# EAGLE design QCCB1 (EAGLE 5.10)
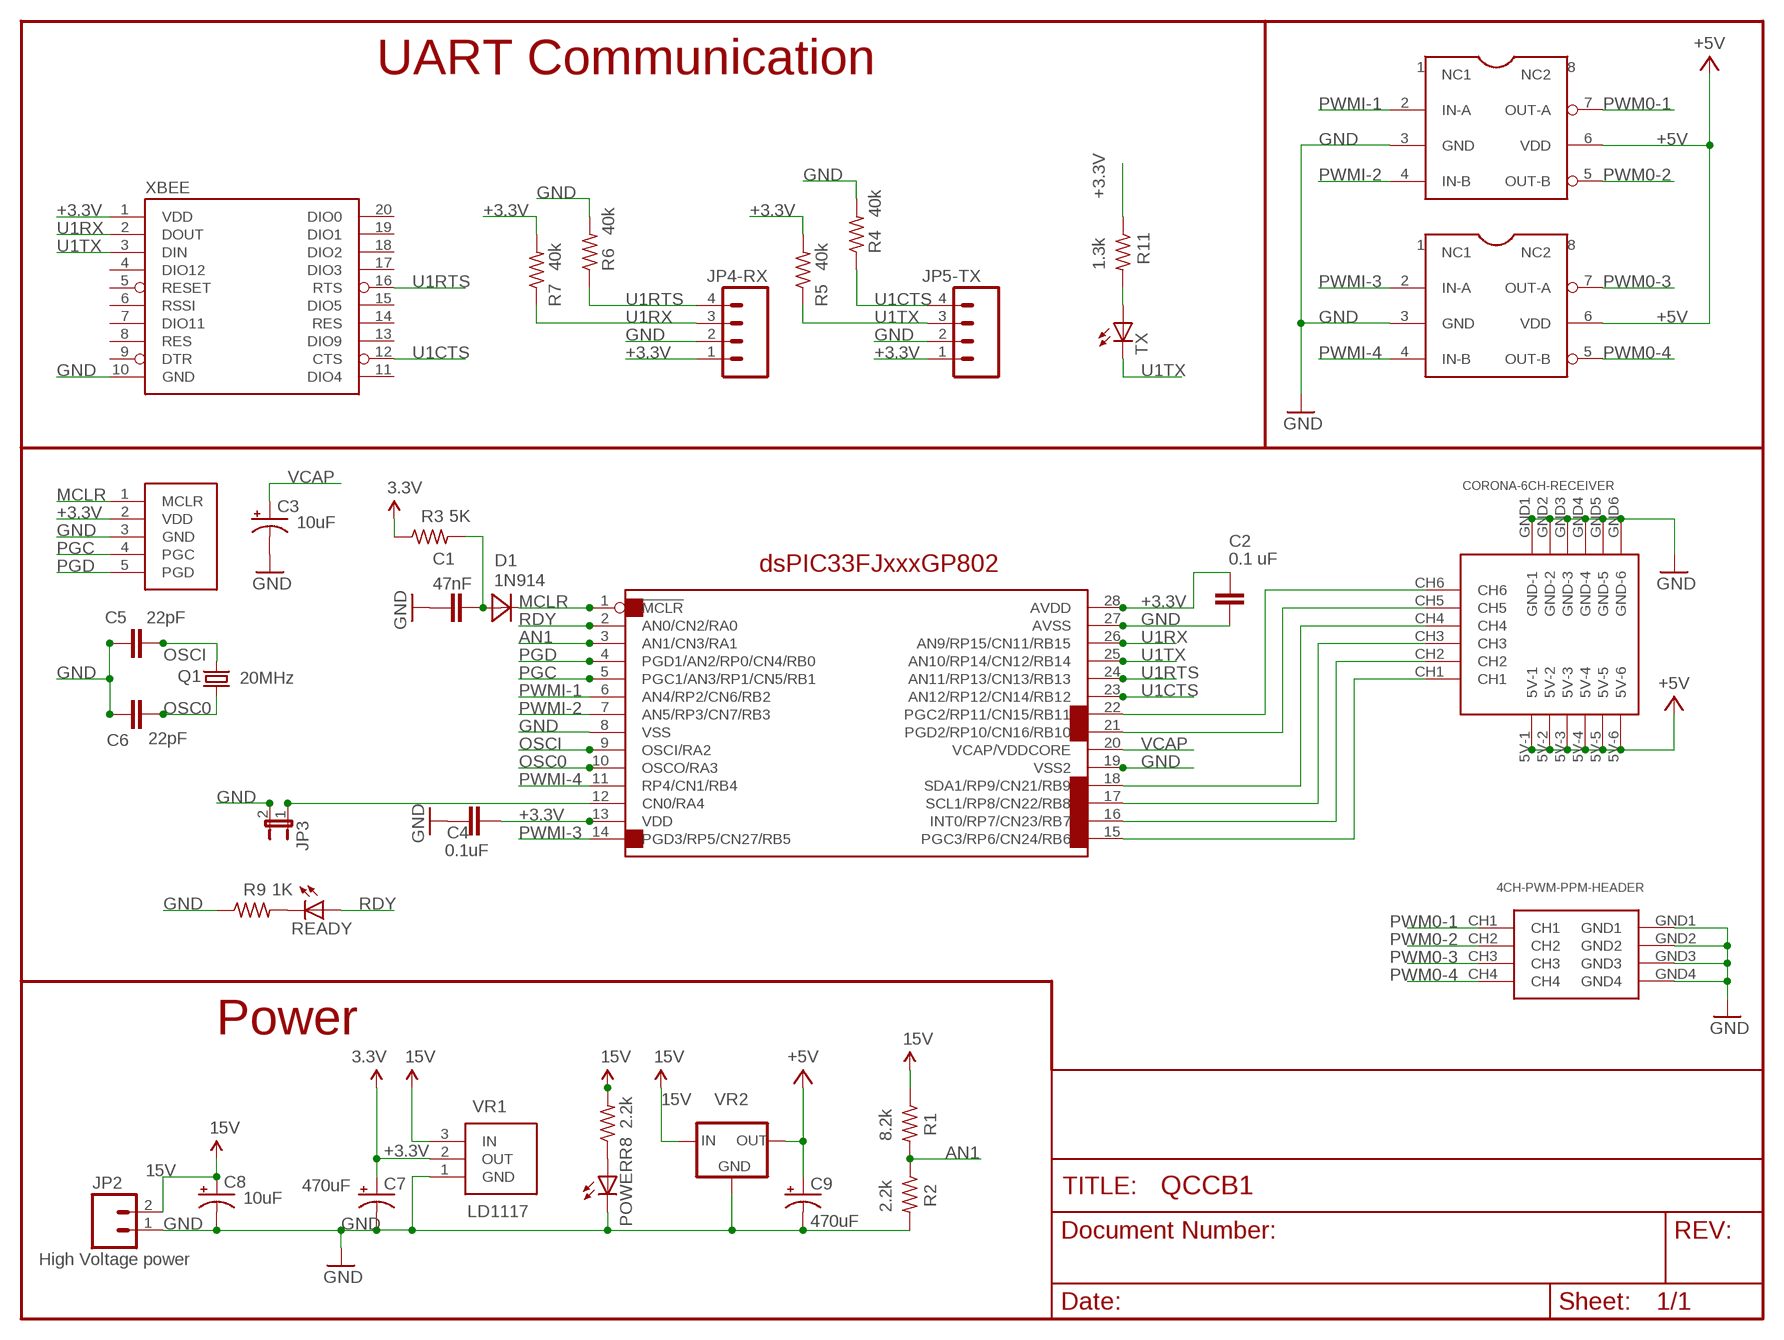
[diagram p0: schematic, sheet 1]

## Parts
C1  47nF  CAPPTH  [CAP-PTH-SMALL]
C2  0.1 uF  CAPPTH  [CAP-PTH-SMALL]
C3  10uF  CPOL-USE2-5  [E2-5]
C4  0.1uF  CAPPTH  [CAP-PTH-SMALL]
C5  22pF  CAPPTH  [CAP-PTH-SMALL]
C6  22pF  CAPPTH  [CAP-PTH-SMALL]
C7  470uF  CPOL-USE3.5-8  [E3,5-8]
C8  10uF  CPOL-USE2-5  [E2-5]
C9  470uF  CPOL-USE3.5-8  [E3,5-8]
CR1  CORONA-6CH-RECEIVER  [CORONA-6CH-RECEIVER-FOOTPRINT]
D1  1N914  [DO34-5]
ICL1  ICL7667  [DIL08]
ICL2  ICL7667  [DIL08]
ICSP  ICSPMOLEX  [ICSP_LONGPADS_MOLEX]
JP2  High Voltage power  M02  [1X02_LONGPADS]
JP3  JUMPER-2PTH_LOCK  [1X02_LOCK]
JP4-RX  M04LOCK_LONGPADS  [1X04_LOCK_LONGPADS]
JP5-TX  M04LOCK_LONGPADS  [1X04_LOCK_LONGPADS]
POWER  LED5MM  [LED5MM]
PWM-PPM  4CH-PWM-PPM-HEADER  [4CH-PWM-PPM-HEADER-PACKAGE]
Q1  20MHz  CRYSTALHC49US  [HC49US]
R1  8.2k  R-US_0204/7  [0204/7]
R2  2.2k  R-US_0204/7  [0204/7]
R3  5K  R-US_0204/7  [0204/7]
R4  40k  R-US_0204/7  [0204/7]
R5  40k  R-US_0204/7  [0204/7]
R6  40k  R-US_0204/7  [0204/7]
R7  40k  R-US_0204/7  [0204/7]
R8  2.2k  R-US_0204/7  [0204/7]
R9  1K  R-US_0204/7  [0204/7]
R11  1.3k  R-US_0204/7  [0204/7]
READY  LED3MM  [LED3MM]
TX  LED3MM  [LED3MM]
U$1  DSPIC33FJXXXGP802-DIGEST  [DIL28-3]
VR1  LD1117  [TO220S]
VR2  78XXS  [78XXS]
XBEE  XBEE-1XBEE-1_LOCK  [XBEE-1_LOCK]

## Nets
15V: C8.+ JP2.2 R1.1 R8.2 VR1.3(IN) VR2.IN
+3.3V: C2.2 C4.2 C7.+ ICSP.2(VDD) JP4-RX.1 JP5-TX.1 R3.1 R5.2 R7.2 R11.1 U$1.13(VDD) U$1.28(AVDD) VR1.2(OUT) XBEE.1(VDD) ; supply symbol labelled 3.3V
+5V: C9.+ CR1.5V-1 CR1.5V-2 CR1.5V-3 CR1.5V-4 CR1.5V-5 CR1.5V-6 ICL1.6(VDD) ICL2.6(VDD) VR2.OUT
AN1: R1.2 R2.1 U$1.3(AN1/CN3/RA1)
GND: C1.2 C2.1 C3.- C4.1 C5.1 C6.1 C7.- C8.- C9.- CR1.GND1(GND-1) CR1.GND2(GND-2) CR1.GND3(GND-3) CR1.GND4(GND-4) CR1.GND5(GND-5) CR1.GND6(GND-6) ICL1.3(GND) ICL2.3(GND) ICSP.3(GND) JP2.1 JP3.2 JP4-RX.2 JP5-TX.2 POWER.K(C) PWM-PPM.GND1 PWM-PPM.GND2 PWM-PPM.GND3 PWM-PPM.GND4 R2.2 R4.2 R6.2 R9.1 U$1.8(VSS) U$1.19(VSS2) U$1.27(AVSS) VR1.1(GND) VR2.GND XBEE.10(GND)
MCLR: D1.C ICSP.1(MCLR) U$1.1(!MCLR)
N$1: C1.1 D1.A R3.2
N$2: JP3.1 U$1.12(CN0/RA4)
N$3: R11.2 TX.A
N$4: R9.2 READY.K(C)
N$5: POWER.A R8.1
N$7: CR1.CH6 U$1.22(PGC2/RP11/CN15/RB11)
N$8: CR1.CH5 U$1.21(PGD2/RP10/CN16/RB10)
N$9: CR1.CH4 U$1.18(SDA1/RP9/CN21/RB9)
N$10: CR1.CH3 U$1.17(SCL1/RP8/CN22/RB8)
N$11: CR1.CH2 U$1.16(INT0/RP7/CN23/RB7)
N$12: CR1.CH1 U$1.15(PGC3/RP6/CN24/RB6)
OSC0: C6.2 Q1.1 U$1.10(OSCO/RA3)
OSCI: C5.2 Q1.2 U$1.9(OSCI/RA2)
PGC: ICSP.4(PGC) U$1.5(PGC1/AN3/RP1/CN5/RB1)
PGD: ICSP.5(PGD) U$1.4(PGD1/AN2/RP0/CN4/RB0)
PWM0-1: ICL1.7(OUT-A) PWM-PPM.CH1
PWM0-2: ICL1.5(OUT-B) PWM-PPM.CH2
PWM0-3: ICL2.7(OUT-A) PWM-PPM.CH3
PWM0-4: ICL2.5(OUT-B) PWM-PPM.CH4
PWMI-1: ICL1.2(IN-A) U$1.6(AN4/RP2/CN6/RB2)
PWMI-2: ICL1.4(IN-B) U$1.7(AN5/RP3/CN7/RB3)
PWMI-3: ICL2.2(IN-A) U$1.14(PGD3/RP5/CN27/RB5)
PWMI-4: ICL2.4(IN-B) U$1.11(RP4/CN1/RB4)
RDY: READY.A U$1.2(AN0/CN2/RA0)
U1CTS: JP5-TX.4 R4.1 U$1.23(AN12/RP12/CN14/RB12) XBEE.12(CTS)
U1RTS: JP4-RX.4 R6.1 U$1.24(AN11/RP13/CN13/RB13) XBEE.16(RTS)
U1RX: JP4-RX.3 R7.1 U$1.26(AN9/RP15/CN11/RB15) XBEE.2(DOUT)
U1TX: JP5-TX.3 R5.1 TX.K(C) U$1.25(AN10/RP14/CN12/RB14) XBEE.3(DIN)
VCAP: C3.+ U$1.20(VCAP/VDDCORE)
Unconnected: ICL1.1(NC1) ICL1.8(NC2) ICL2.1(NC1) ICL2.8(NC2) XBEE.4(DIO12) XBEE.5(RESET) XBEE.6(RSSI) XBEE.7(DIO11) XBEE.8(RES) XBEE.9(DTR) XBEE.11(DIO4) XBEE.13(DIO9) XBEE.14(RES) XBEE.15(DIO5) XBEE.17(DIO3) XBEE.18(DIO2) XBEE.19(DIO1) XBEE.20(DIO0)

## Notes on the sheet
- UART Communication
- Power

## Library data of the parts
C1 C2 C4-C6 = SparkFun:CAP: Capacitor Standard 0603 ceramic capacitor, and 0.1" leaded capacitor.
C3 C7-C9 = rcl:CPOL-US: POLARIZED CAPACITOR, American symbol
CR1 = AZ Custom:CORONA-6CH-RECEIVER
D1 = AZ Custom:1N914
ICL1 ICL2 = AZ Custom:ICL7667: ICL7667 Dual MOSFET driver
ICSP = AZ Custom:ICSP
JP2 = SparkFun:M02: Header 2 Standard 2-pin 0.1" header. Use with straight break away headers (SKU : PRT-00116), right angle break away headers (PRT-00553), swiss pins (PRT-00743), machine pins (PRT-00117), and female headers (PRT-00115). Molex polarized connector foot print use with SKU : PRT-08233 with associated crimp pins and housings.
JP3 = SparkFun:JUMPER-2: Jumper Basic 0.1" spaced jumper. Use with breakaway headers.
JP4-RX JP5-TX = SparkFun:M04: Header 4 Standard 4-pin 0.1" header. Use with straight break away headers (SKU : PRT-00116), right angle break away headers (PRT-00553), swiss pins (PRT-00743), machine pins (PRT-00117), and female headers (PRT-00115). Molex polarized connector foot print use with SKU : PRT-08231 with associated crimp pins and housings.
POWER READY TX = SparkFun:LED: LEDs Standard schematic elements and footprints for 5mm, 3mm, 1206, and 0603 sized LEDs. 5mm - Spark Fun Electronics SKU : COM-00529 (and others)
PWM-PPM = AZ Custom:4CH-PWM-PPM-HEADER
Q1 = SparkFun:CRYSTAL: Crystals Various standard crystals. Proven footprints. Spark Fun Electronics SKU : COM-00534
R1-R9 R11 = resistor:R-US_: RESISTOR, American symbol
U$1 = AZ Custom:DSPIC33FJXXXGP802-DIGEST
VR1 = AZ Custom:LD1117: LD1117 series voltage regulator (including LD33V)
VR2 = v-reg:78XXS: VOLTAGE REGULATOR
XBEE = AZ Custom:XBEE-1

## Board
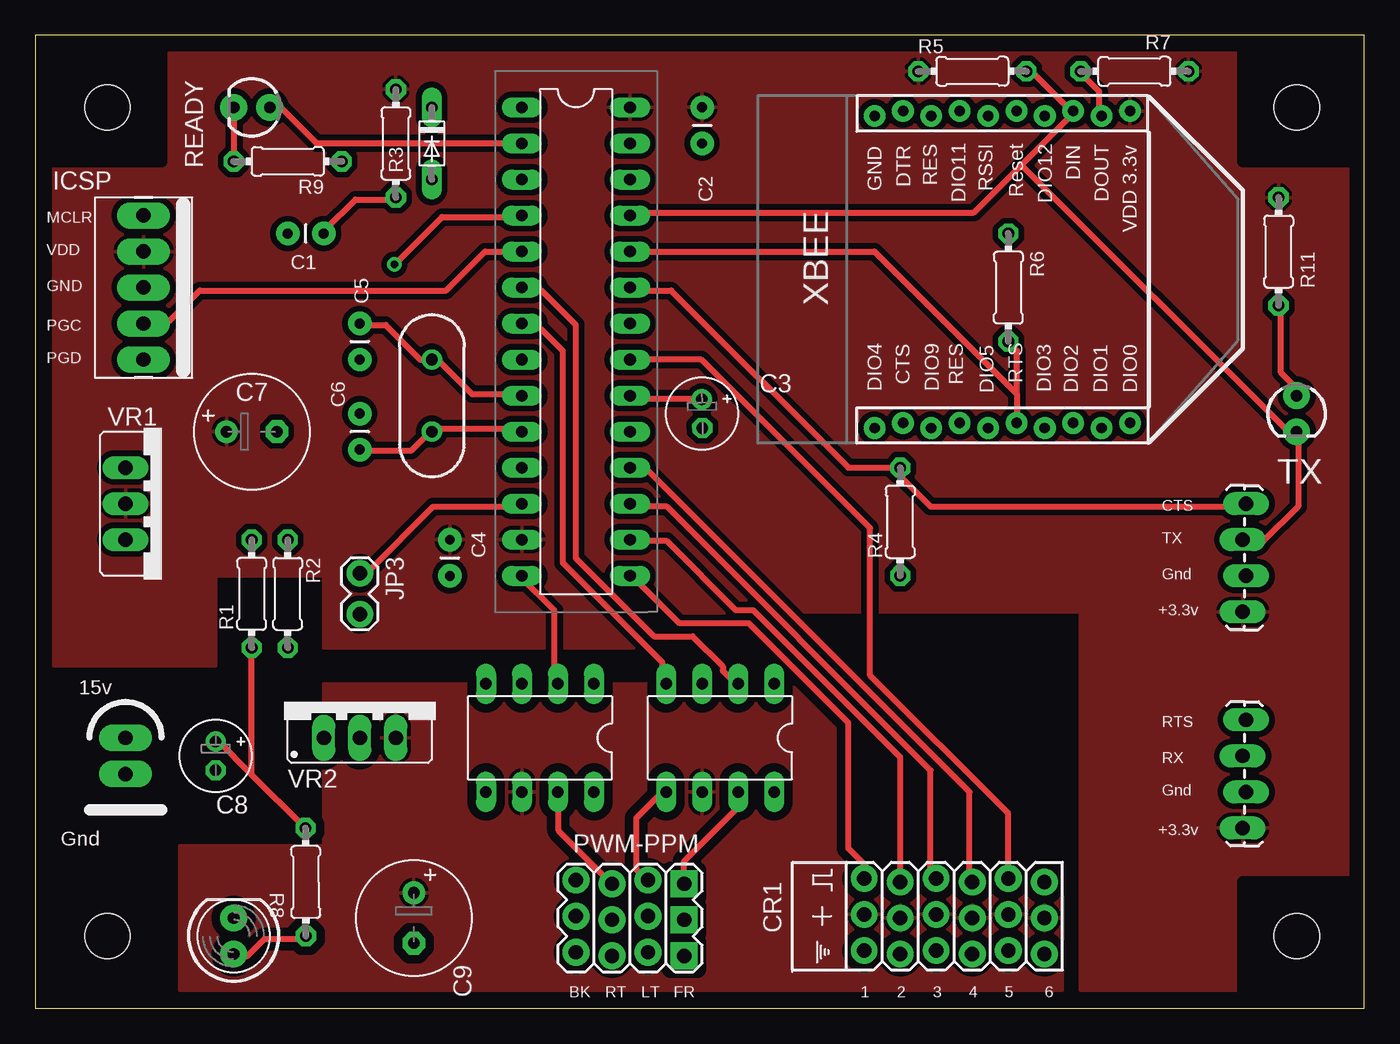
[diagram p1: board, top side]
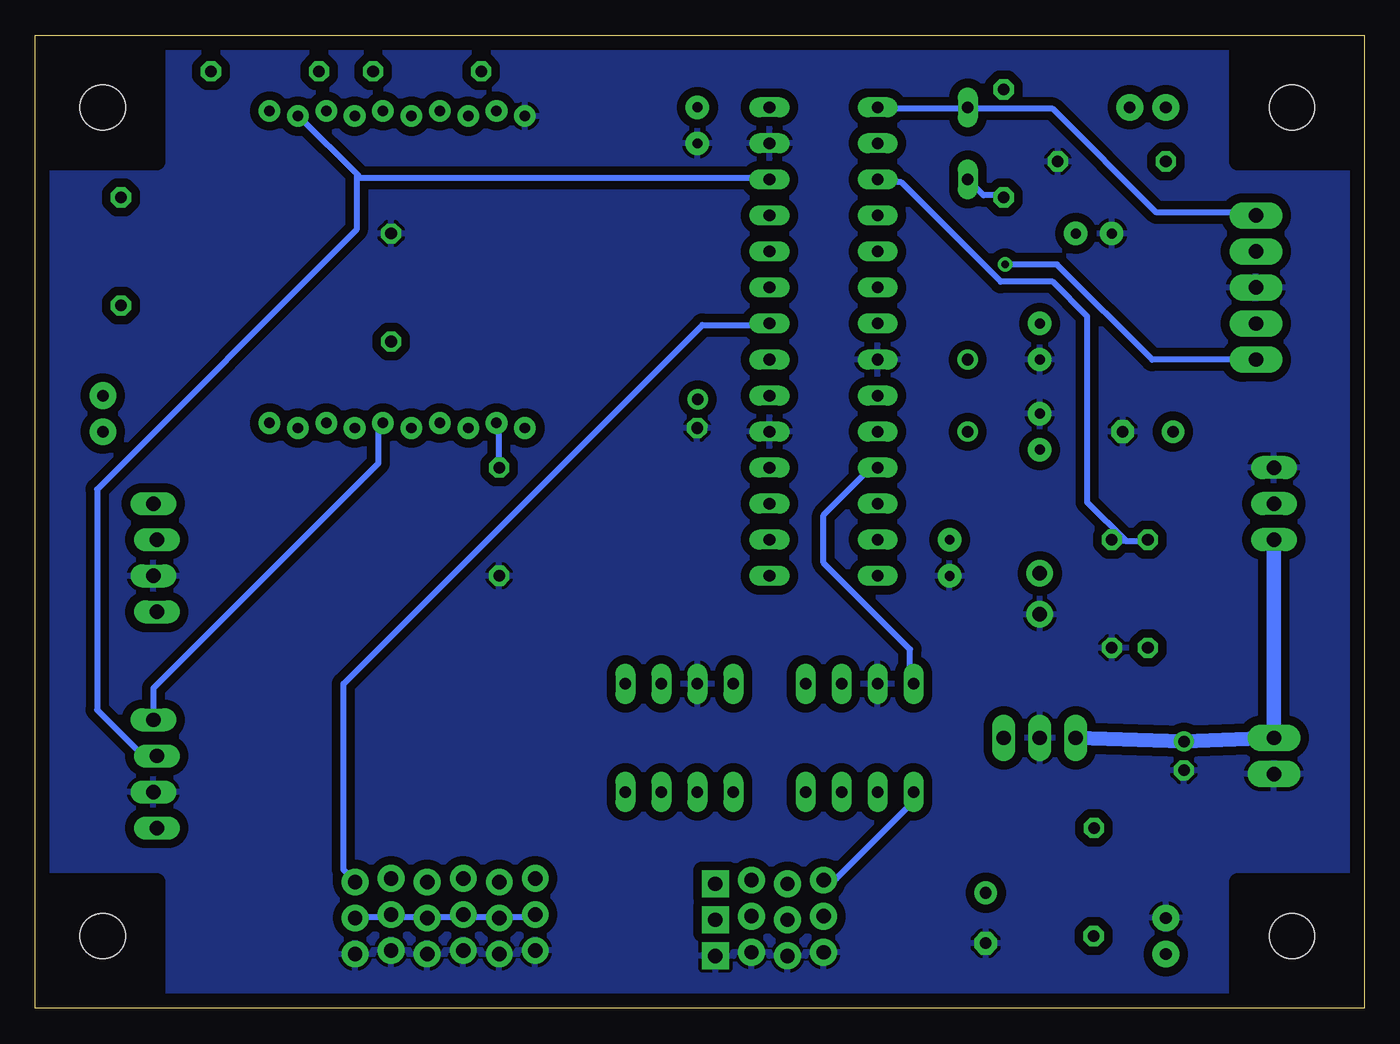
[diagram p2: board, bottom side, seen from below]

Size 93.65 x 68.57 mm. Coordinates in mm from the lower left corner, seen from the top.
Outline: 0,0 93.65,0 93.65,68.57 0,68.57 0,0
Copper layers (1*16): Top 0.035mm / dielectric 1.5mm / Bottom 0.035mm
Design rules "AZCustom *": minimum track width 16mil, minimum drill 20mil, track to track 10mil, track to pad 12mil, pad to pad 12mil, via to via 8mil, smd to smd 8mil, copper to edge 40mil, drill to drill 12mil, minimum pad ring 12mil, minimum via ring 10mil, stop-mask expansion 4mil, vias tented up to drill 25mil, thermal gap 10mil
Holes 3.2 mm at 5.08,5.08 5.08,63.5 88.9,63.5 88.9,5.08
tRestrict: area 0,0 to 8.9,8.9; area 85.1,0 to 94,8.9; area 85.1,59.7 to 94,68.6; area 0,59.7 to 8.9,68.6
bRestrict: area 0,59.7 to 8.9,68.6; area 85.1,59.7 to 94,68.6; area 85.1,0 to 94,8.9; area 0,0 to 8.9,8.9

### Footprints (pad centres in the part's own frame; a part is rotated, then mirrored left to right if it is on the bottom)
CAP-PTH-SMALL = drill 0.7 pad 1.651 round: 1 0,0; 2 2.54,0
E2-5 = drill 0.813 pad 1.27 round: + -1.016,0 | drill 0.813 pad 1.27 octagon: - 1.016,0
E3,5-8 = drill 0.813 pad 1.6 round: + -1.778,0 | drill 0.813 pad 1.6 octagon: - 1.778,0
CORONA-6CH-RECEIVER-FOOTPRINT = drill 1.016 pad 1.88 round: 5V-1 0.254,6.35; 5V-2 0,3.81; 5V-3 0.254,1.27; 5V-4 0,-1.27; 5V-5 0.254,-3.81; 5V-6 0,-6.35; CH1 2.794,6.35; CH2 2.54,3.81; CH3 2.794,1.27; CH4 2.54,-1.27; CH5 2.794,-3.81; CH6 2.54,-6.35; GND1 -2.286,6.35; GND2 -2.54,3.81; GND3 -2.286,1.27; GND4 -2.54,-1.27; GND5 -2.286,-3.81; GND6 -2.54,-6.35
DO34-5 = drill 0.813 long: A 2.54,0; C -2.54,0
DIL08 = drill 0.813 long: 1 -3.81,-3.81; 2 -1.27,-3.81; 3 1.27,-3.81; 4 3.81,-3.81; 5 3.81,3.81; 6 1.27,3.81; 7 -1.27,3.81; 8 -3.81,3.81
ICSP_LONGPADS_MOLEX = drill 1.016 pad 1.88 long: 1 0,5.08; 2 0,2.54; 3 0,0; 4 0,-2.54; 5 0,-5.08
1X02_LONGPADS = drill 1.016 pad 1.88 long: 1 0,0; 2 2.54,0
1X02_LOCK = drill 1.016 pad 1.88 round: 1 -0.178,0; 2 2.718,0
1X04_LOCK_LONGPADS = drill 1.016 long: 1 0,0; 2 2.54,-0.254; 3 5.08,0; 4 7.62,-0.254
LED5MM = drill 0.813 pad 1.88 round: A -1.27,0; K 1.27,0
4CH-PWM-PPM-HEADER-PACKAGE = drill 1.016 pad 1.88 square: 5V-1 3.81,-0.127; CH1 3.81,2.413; GND1 3.81,-2.667 | drill 1.016 pad 1.88 round: 5V-2 1.27,0.127; 5V-3 -1.27,-0.127; 5V-4 -3.81,0.127; CH2 1.27,2.667; CH3 -1.27,2.413; CH4 -3.81,2.667; GND2 1.27,-2.413; GND3 -1.27,-2.667; GND4 -3.81,-2.413
HC49US = drill 0.813 round: 1 -2.54,0; 2 2.54,0
0204/7 = drill 0.813 octagon: 1 -3.81,0; 2 3.81,0
LED3MM = drill 0.813 pad 1.88 round: A -1.27,0; K 1.27,0
DIL28-3 = drill 0.813 long: 1 -16.51,-3.81; 2 -13.97,-3.81; 3 -11.43,-3.81; 4 -8.89,-3.81; 5 -6.35,-3.81; 6 -3.81,-3.81; 7 -1.27,-3.81; 8 1.27,-3.81; 9 3.81,-3.81; 10 6.35,-3.81; 11 8.89,-3.81; 12 11.43,-3.81; 13 13.97,-3.81; 14 16.51,-3.81; 15 16.51,3.81; 16 13.97,3.81; 17 11.43,3.81; 18 8.89,3.81; 19 6.35,3.81; 20 3.81,3.81; 21 1.27,3.81; 22 -1.27,3.81; 23 -3.81,3.81; 24 -6.35,3.81; 25 -8.89,3.81; 26 -11.43,3.81; 27 -13.97,3.81; 28 -16.51,3.81
TO220S = drill 1.016 long: 1 -5.08,1.27; 2 -2.54,1.27; 3 0,1.27
78XXS = drill 1.016 long: GND 0,-2.54; IN -2.54,-2.54; OUT 2.54,-2.54
XBEE-1_LOCK = drill 0.737 pad 1.524 round: 1 -11.178,20; 2 -10.822,18; 3 -11.178,16; 4 -10.822,14; 5 -11.178,12; 6 -10.822,10; 7 -11.178,8; 8 -10.822,6; 9 -11.178,4; 10 -10.822,2; 11 11.178,2; 12 10.822,4; 13 11.178,6; 14 10.822,8; 15 11.178,10; 16 10.822,12; 17 11.178,14; 18 10.822,16; 19 11.178,18; 20 10.822,20

### Placement (x,y rotation side)
C1  20.32,54.61 180 top
C2  46.99,60.96 90 top
C3  46.99,41.91 271.1 top
C4  29.21,30.48 90 top
C5  22.86,45.72 90 top
C6  22.86,41.91 270 top
C7  15.24,40.64 0.1 top
C8  12.7,17.78 270 top
C9  26.67,6.35 270 top
CR1  64.77,6.35 90 top
D1  27.94,60.96 270 top
ICL1  48.26,19.05 180 top
ICL2  35.56,19.05 180 top
ICSP  7.62,50.8 0 top
JP2  6.35,16.51 90 top
JP3  22.86,30.48 270 top
JP4-RX  85.09,12.7 90 top
JP5-TX  85.09,27.94 90 top
POWER  13.97,5.08 90 top
PWM-PPM  41.91,6.35 0 top
Q1  27.94,43.18 90 top
R1  15.24,29.21 90 top
R2  17.78,29.21 270 top
R3  25.4,60.96 270 top
R4  60.96,34.29 270 top
R5  66.04,66.04 180 top
R6  68.58,50.8 90 top
R7  77.47,66.04 0 top
R8  19.05,8.89 90.2 top
R9  17.78,59.69 180 top
R11  87.63,53.34 270 top
READY  15.24,63.5 180 top
TX  88.9,41.91 270 top
U$1  38.1,46.99 270 top
VR1  5.08,33.02 270 top
VR2  22.86,21.59 0 top
XBEE  57.15,52.07 270 top

### Tracks (layer width: path | path; a pad name or v marks a point on that pad's centre or on a via)
15V
  Top 0.406: 15.24,16.46 12.8,18.9 C8.+ | 15.24,16.46 18.9,12.8 R8.2 | 15.24,16.46 R1.1
  Bottom 1.016: VR1.3 JP2.2 C8.+ VR2.IN
+3.3V
  pour Top (isolate 0.406): 1.27,24.13 12.7,24.13 12.7,30.48 20.32,30.48 20.32,25.4 49.53,25.4 49.53,27.94 73.66,27.94 73.66,1.27 92.71,1.27 92.71,67.31 1.27,67.31
+5V
  Bottom 0.406: 60.96,6.4 58.52,6.4 CR1.5V-1 | 60.96,6.4 63.4,6.4 CR1.5V-3 63.7,6.4 65.84,6.4 CR1.5V-4 66.14,6.4 68.58,6.4 | 60.96,6.4 CR1.5V-2 | 68.58,6.4 71.02,6.4 CR1.5V-6 | 68.58,6.4 CR1.5V-5
  pour Top (isolate 0.61): 10.16,1.27 10.16,11.43 20.32,11.43 20.32,22.86 50.8,22.86 72.39,22.86 72.39,1.27
AN1
  Bottom 0.406: 16.76,32.92 17.68,32.92 R2.1 | 16.76,32.92 15.24,32.92 R1.2 | 16.76,32.92 19.51,35.66 19.51,48.77 21.95,51.21 25.6,51.21 32.61,58.22 34.14,58.22 U$1.3
GND
  pour Bottom (isolate 0.61): 0,68.58 93.98,68.58 93.98,0 0,0
MCLR
  Bottom 0.406: U$1.1 34.14,63.4 28.04,63.4 D1.C 27.74,63.4 21.95,63.4 14.63,56.08 7.62,56.08 ICSP.1
N$1
  Top 0.406: C1.1 20.42,54.86 22.55,57 25.3,57 R3.2
  Bottom 0.406: D1.A 26.82,57.3 25.6,57.3 R3.2
N$2
  Top 0.406: U$1.12 34.14,35.36 28.04,35.36 23.47,30.79 22.86,30.79 JP3.1
N$3
  Top 0.406: R11.2 87.78,49.38 87.78,44.81 88.7,43.89 88.7,43.28 TX.A
N$4
  Top 0.406: R9.2 14.02,59.74 14.02,63.4 READY.K
N$5
  Top 0.406: R8.1 18.9,4.88 16.15,4.88 14.94,3.66 14.02,3.66 POWER.A
N$7
  Bottom 0.406: U$1.22 42.06,48.16 46.63,48.16 71.93,22.86 71.93,9.75 71.32,9.14 CR1.CH6
N$8
  Top 0.406: CR1.CH5 68.58,13.72 58.83,23.47 58.83,33.83 46.94,45.72 U$1.21
N$9
  Top 0.406: U$1.18 42.98,38.1 65.84,15.24 65.84,9.14 CR1.CH4
N$10
  Top 0.406: U$1.17 42.06,35.36 44.5,35.36 63.09,16.76 63.09,9.45 63.4,9.14 CR1.CH3
N$11
  Top 0.406: U$1.16 42.06,32.92 44.5,32.92 49.38,28.04 50.6,28.04 60.96,17.68 CR1.CH2
N$12
  Top 0.406: U$1.15 42.06,30.48 45.41,27.13 50.29,27.13 57.3,20.12 57.3,11.28 58.52,10.06 58.52,9.14 CR1.CH1
OSC0
  Top 0.406: C6.2 22.86,39.32 26.52,39.32 27.74,40.54 Q1.1 28.04,40.84 34.14,40.84 U$1.10
OSCI
  Top 0.406: C5.2 22.86,48.16 24.69,48.16 27.13,45.72 Q1.2 28.35,45.72 30.79,43.28 34.14,43.28 U$1.9
PGC
  Top 0.406: U$1.5 31.7,53.34 28.96,50.6 11.58,50.6 9.45,48.46 7.62,48.46 ICSP.4
PGD  (via drill 0.51)
  Top 0.406: v25.3,52.43 28.65,55.78 34.14,55.78 U$1.4
  Bottom 0.406: v25.3,52.43 21.64,52.43 14.94,45.72 ICSP.5
PWM0-1
  Top 0.406: ICL1.7 49.38,15.24 49.38,14.02 45.72,10.36 PWM-PPM.CH1
PWM0-2
  Top 0.406: ICL1.5 44.2,15.24 42.37,13.41 42.37,9.75 42.98,9.14 PWM-PPM.CH2
PWM0-3
  Top 0.406: ICL2.7 36.88,15.24 36.88,12.5 40.54,8.84 PWM-PPM.CH3
PWM0-4
  Bottom 0.406: ICL2.5 32,15.24 32,14.33 37.19,9.14 38.1,9.14 PWM-PPM.CH4
PWMI-1
  Top 0.406: ICL1.2 49.38,22.86 48.46,23.77 48.46,24.08 46.33,26.21 43.59,26.21 38.1,31.7 38.1,48.16 35.66,50.6 34.44,50.6 U$1.6
PWMI-2
  Top 0.406: ICL1.4 44.2,22.86 44.2,24.38 37.19,31.39 37.19,46.33 35.36,48.16 34.44,48.16 U$1.7
PWMI-3
  Top 0.406: ICL2.2 36.58,22.86 36.58,28.04 34.14,30.48 U$1.14
PWMI-4
  Bottom 0.406: ICL2.4 32,22.86 32,25.3 38.1,31.39 38.1,34.75 34.75,38.1 U$1.11
RDY
  Top 0.406: U$1.2 19.81,60.96 17.37,63.4 16.76,63.4 READY.A
U1CTS
  Top 0.406: 60.35,38.1 57.3,38.1 44.81,50.6 42.06,50.6 U$1.23 | 60.35,38.1 63.09,35.36 85.34,35.36 JP5-TX.4 | 60.35,38.1 R4.1
  Bottom 0.406: R4.1 60.96,41.15 XBEE.12
U1RTS
  Top 0.406: 69.19,43.28 69.19,46.33 68.58,46.94 R6.1 | 69.19,43.28 69.19,41.45 XBEE.16 | 69.19,43.28 59.13,53.34 U$1.24
  Bottom 0.406: JP4-RX.4 85.34,22.55 69.49,38.41 69.49,40.84 69.19,41.15 XBEE.16
U1RX
  Top 0.406: XBEE.2 74.98,63.09 74.98,64.62 73.76,65.84 R7.1
  Bottom 0.406: 71.02,58.83 74.98,62.79 XBEE.2 | 71.02,58.83 70.71,58.52 42.06,58.52 U$1.26 | 71.02,58.83 71.02,54.86 89.31,36.58 89.31,21.03 86.26,17.98 85.34,17.98 JP4-RX.3
U1TX
  Top 0.406: JP5-TX.3 85.34,32.92 86.56,32.92 89,35.36 89,40.54 TX.K 88.7,40.84 88.09,40.84 69.49,59.44 | R5.1 70.1,66.14 72.85,63.4 XBEE.3 73.15,63.09 69.49,59.44 | 69.49,59.44 66.14,56.08 42.06,56.08 U$1.25
VCAP
  Top 0.406: U$1.20 42.06,42.98 46.94,42.98 C3.+

### Text on the board
tPlace: CTS | TX | Gnd | +3.3v | 15v | RTS | RX | Gnd | +3.3v | Gnd | BK | RT | LT | FR | 1 | 2 | 3 | 4 | 5 | 6